# Altium schematic sheet Control_Module_MAIN.SchDoc: Módulo de Control - Vista General
size A4; Author: Martin C.A. Yunis; CompanyName: Sistema de Control de Acceso; Revision: V1; SheetNumber: 1; SheetTotal: 7
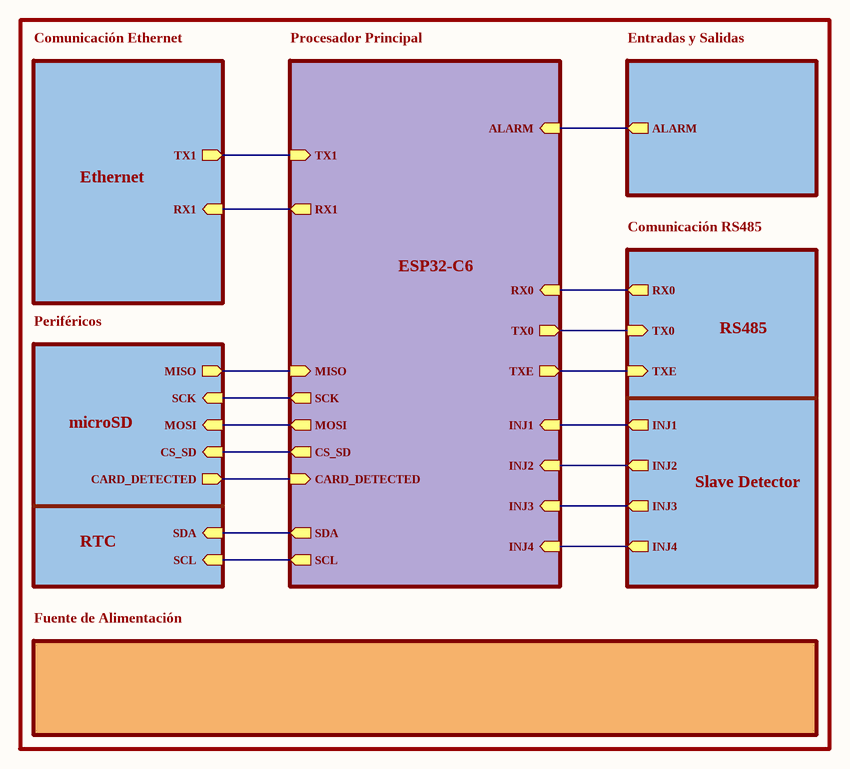
[diagram p0: Control_Module_MAIN.SchDoc]

## Sub-sheets
Comunicación Ethernet = Control_Module_ETH: TX1 (out), RX1 (in)
Comunicación RS485 = Control_Module_RS485: RX0 (out), TX0 (in), TXE (in), INJ1 (out), INJ2 (out), INJ3 (out), INJ4 (out)
Entradas y Salidas = Control_Module_IO: ALARM (out)
Fuente de Alimentación = Control_Module_PSU: no entries
Periféricos = Control_Module_PER: MISO (out), SCK (in), MOSI (in), CS_SD (in), CARD_DETECTED (out), SDA (in), SCL (in)
Procesador Principal = Control_Module_CPU: MISO (in), SCK (out), MOSI (out), CS_SD (out), CARD_DETECTED (in), SDA (out), SCL (out), ALARM (in), RX1 (out), RX0 (in), TX0 (out), TXE (out), INJ1 (in), TX1 (in), INJ2 (in), INJ3 (in), INJ4 (in)

## Nets
(unnamed): sheet Comunicación Ethernet/TX1, sheet Procesador Principal/TX1
(unnamed): sheet Comunicación Ethernet/RX1, sheet Procesador Principal/RX1
(unnamed): sheet Procesador Principal/MISO, sheet Periféricos/MISO
(unnamed): sheet Procesador Principal/SCK, sheet Periféricos/SCK
(unnamed): sheet Procesador Principal/MOSI, sheet Periféricos/MOSI
(unnamed): sheet Procesador Principal/CS_SD, sheet Periféricos/CS_SD
(unnamed): sheet Procesador Principal/CARD_DETECTED, sheet Periféricos/CARD_DETECTED
(unnamed): sheet Procesador Principal/SDA, sheet Periféricos/SDA
(unnamed): sheet Procesador Principal/SCL, sheet Periféricos/SCL
(unnamed): sheet Procesador Principal/ALARM, sheet Entradas y Salidas/ALARM
(unnamed): sheet Procesador Principal/RX0, sheet Comunicación RS485/RX0
(unnamed): sheet Procesador Principal/TX0, sheet Comunicación RS485/TX0
(unnamed): sheet Procesador Principal/TXE, sheet Comunicación RS485/TXE
(unnamed): sheet Procesador Principal/INJ1, sheet Comunicación RS485/INJ1
(unnamed): sheet Procesador Principal/INJ2, sheet Comunicación RS485/INJ2
(unnamed): sheet Procesador Principal/INJ3, sheet Comunicación RS485/INJ3
(unnamed): sheet Procesador Principal/INJ4, sheet Comunicación RS485/INJ4

## Notes on the sheet
- Ethernet
- ESP32-C6
- RS485
- microSD
- Slave Detector
- RTC
- Title:
- Size:
- Author:
- A4
- Sheet
- of
- Revision:
- File:
- Date: